# Altium project BMU_v50.PrjPcb (part 4 of 5)

## Sheet BMU_V50_MCUcomplex.SchDoc
size C
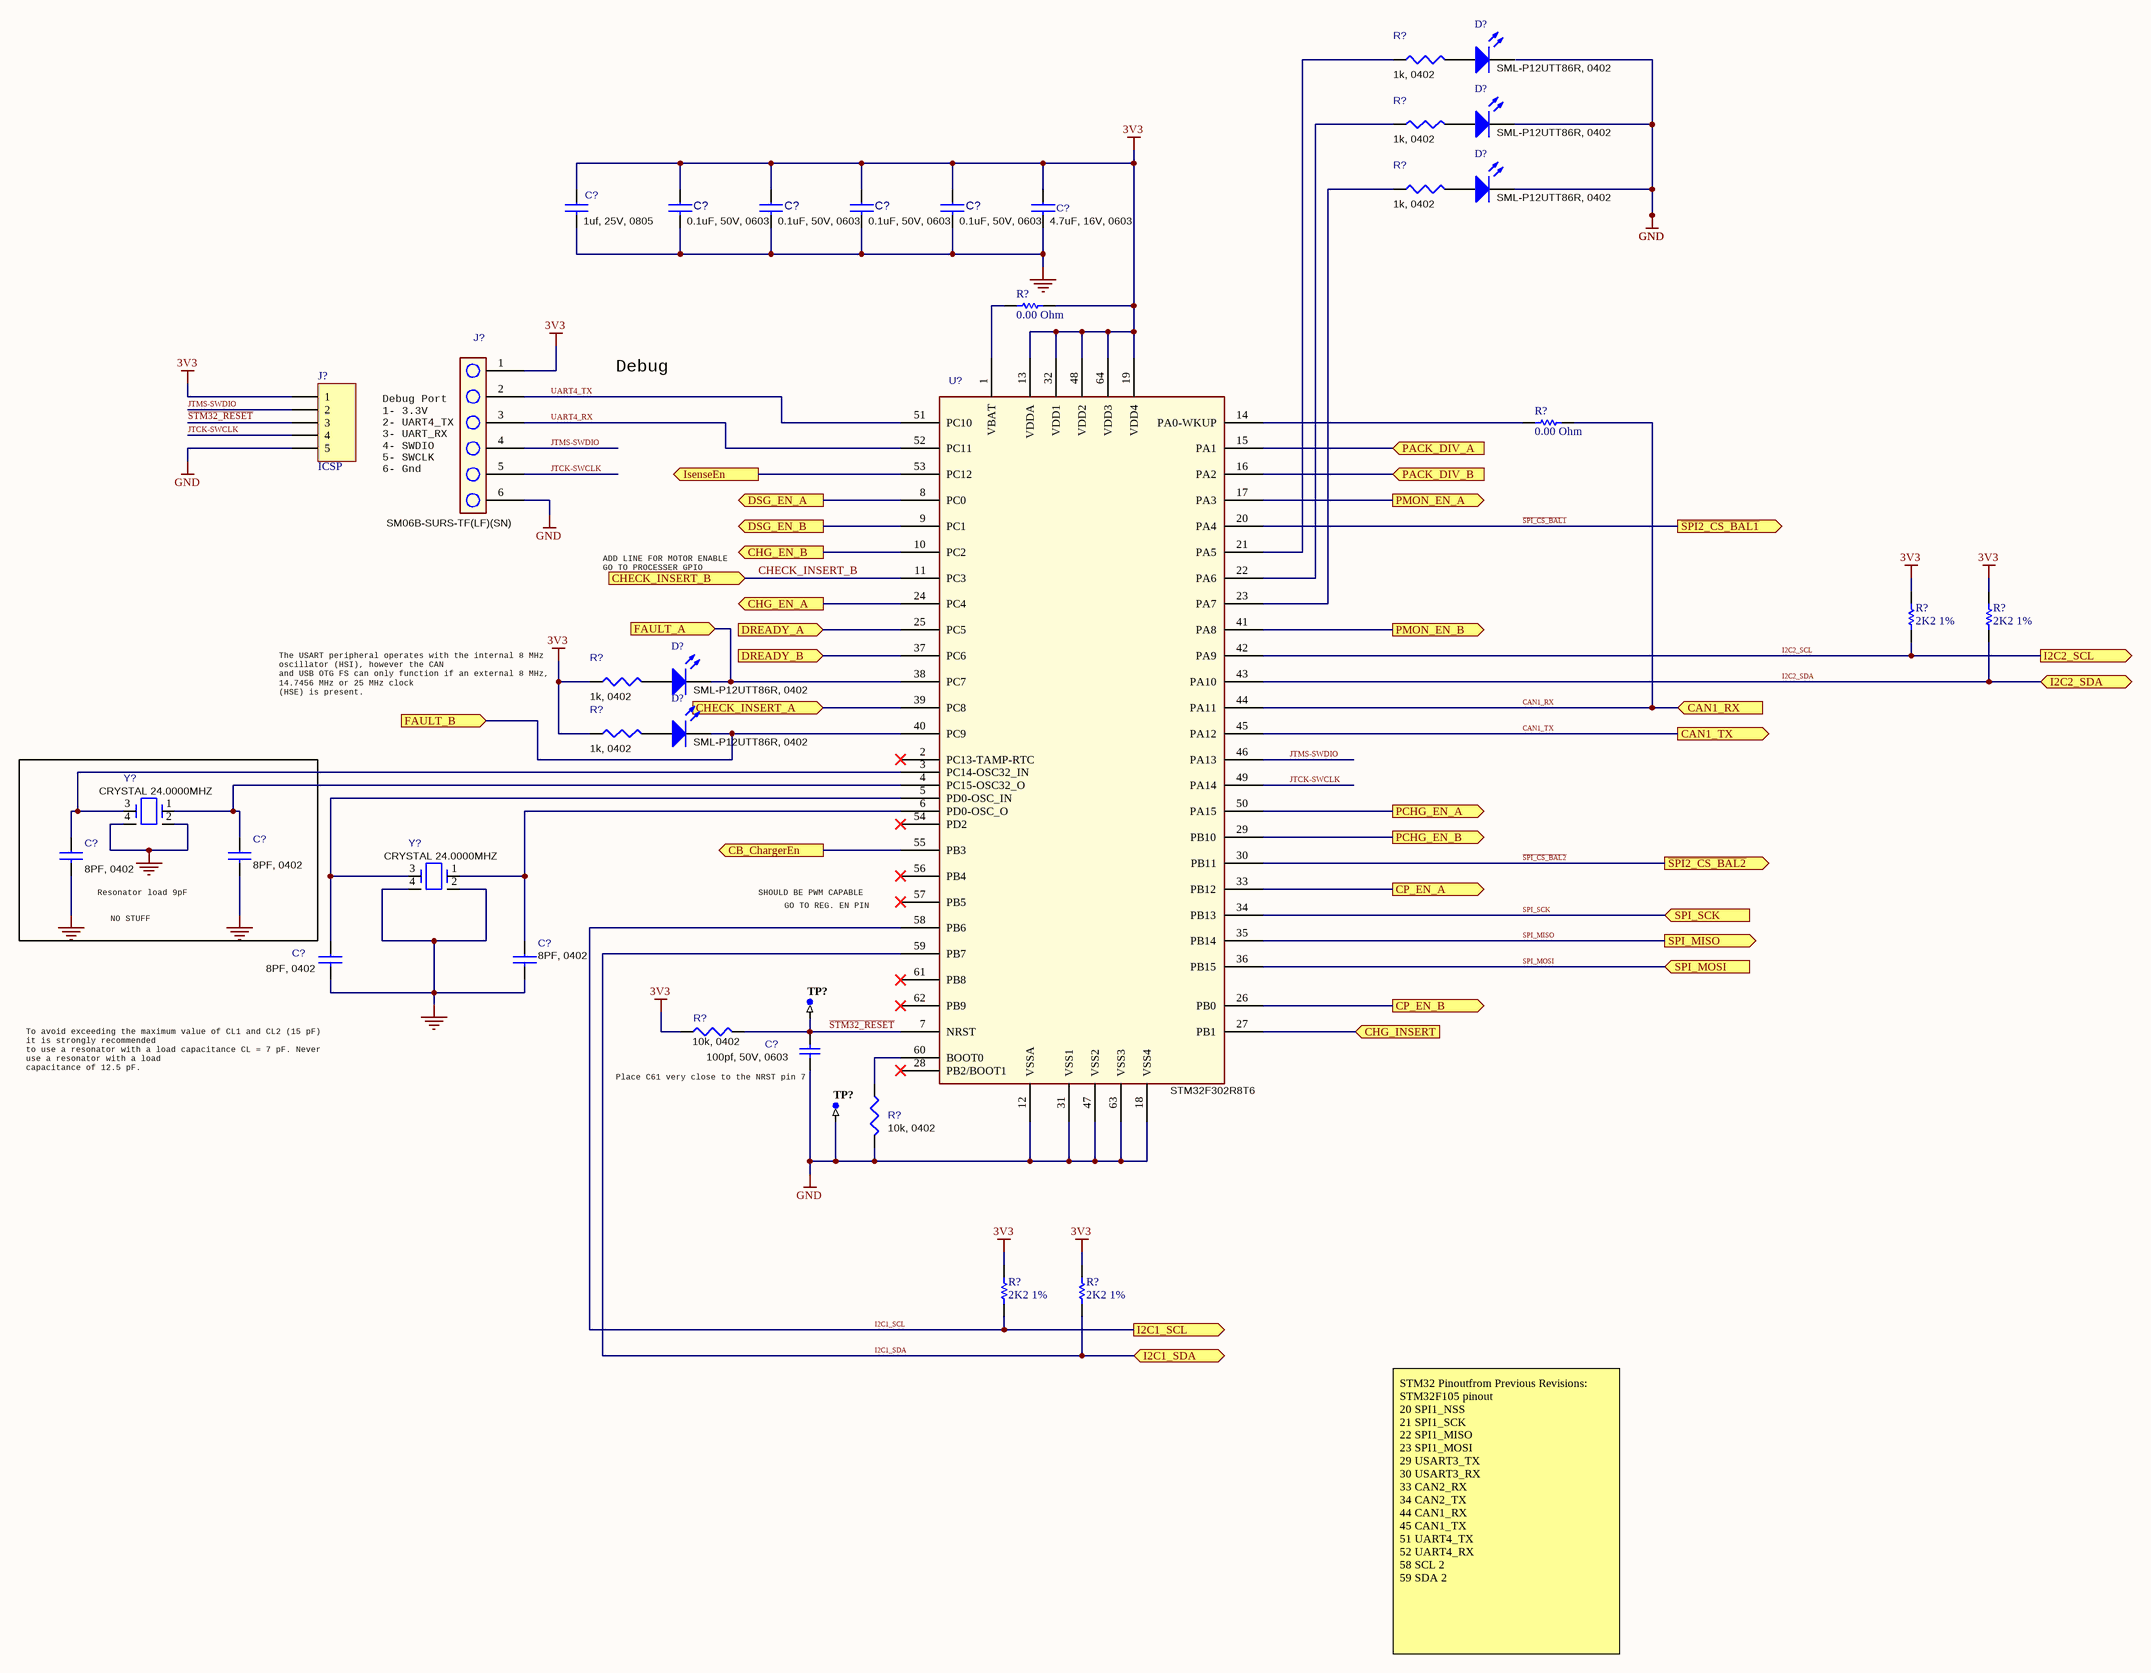
[diagram p9: BMU_V50_MCUcomplex.SchDoc]

### Parts
(Parts that share a designator on the sheet are numbered #1, #2 ... from top to bottom, then left to right.)
C?#1  1uf, 25V, 0805  [C0805]
C?#2  0.1uF, 50V, 0603  [C0603]
C?#3  0.1uF, 50V, 0603  [C0603]
C?#4  0.1uF, 50V, 0603  [C0603]
C?#5  0.1uF, 50V, 0603  [C0603]
C?#6  4.7uF, 16V, 0603  [C0805]
C?#7  8PF, 0402  [C0402]
C?#8  8PF, 0402  [C0402]
C?#9  8PF, 0402  [C0402]
C?#10  8PF, 0402  [C0402]
C?#11  100pf, 50V, 0603  [C0603]
D?#1  SML-P12UTT86R, 0402  [D0402_1]
D?#2  SML-P12UTT86R, 0402  [D0402_1]
D?#3  SML-P12UTT86R, 0402  [D0402_1]
D?#4  SML-P12UTT86R, 0402  [D0402_1]
D?#5  SML-P12UTT86R, 0402  [D0402_1]
J?#4  SM06B-SURS-TF(LF)(SN)  [0.8mm]
J?#5  ICSP  [TC2030-MCP-NL]  (no BOM)
R?#4  1k, 0402  [R0402]
R?#5  1k, 0402  [R0402]
R?#6  1k, 0402  [R0402]
R?#7  value 0.00 Ohm  [RESC0402(1005)_L]  (hidden comment: Jumper 0402(1005))
R?#8  value 0.00 Ohm  [RESC0402(1005)_L]  (hidden comment: Jumper 0402(1005))
R?#9  2K2 1%  [RESC0402(1005)_L]
R?#10  2K2 1%  [RESC0402(1005)_L]
R?#11  1k, 0402  [R0402]
R?#12  1k, 0402  [R0402]
R?#13  10k, 0402  [R0402]
R?#14  10k, 0402  [R0402]
R?#15  2K2 1%  [RESC0402(1005)_L]
R?#16  2K2 1%  [RESC0402(1005)_L]
TP?#1  TP-SM-C-100  [TP-SM-C-100]  (value not drawn)  (no BOM)
TP?#2  TP-SM-C-100  [TP-SM-C-100]  (value not drawn)  (no BOM)
U?#1  STM32F302R8T6  [64LQFP]
Y?#1  CRYSTAL 24.0000MHZ  [CRYSTAL_NX3225SA]
Y?#2  CRYSTAL 24.0000MHZ  [CRYSTAL_NX3225SA]

### Ports
CAN1_RX (in), CAN1_TX (out), CB_ChargerEn (out), CHECK_INSERT_A (in), CHECK_INSERT_B (in), CHG_EN_A (out), CHG_EN_B (out), CHG_INSERT (in), CP_EN_A (out), CP_EN_B (out), DREADY_A (in), DREADY_B (in), DSG_EN_A (out), DSG_EN_B (out), FAULT_A (in), FAULT_B (in), I2C1_SCL (out), I2C1_SDA (bidir), I2C2_SCL (out), I2C2_SDA (bidir), IsenseEn (out), PACK_DIV_A (in), PACK_DIV_B (in), PCHG_EN_A (out), PCHG_EN_B (out), PMON_EN_A (out), PMON_EN_B (out), SPI_MISO (out), SPI_MOSI (in), SPI_SCK (in), ~{SPI2_CS_BAL1} (out), ~{SPI2_CS_BAL2} (out)

### Nets
3V3: C?#1.1 C?#2.1 C?#3.1 C?#4.1 C?#5.1 C?#6.1 J?#4.1 J?#5.1 R?#7.1 R?#9.2 R?#10.2 R?#11.1 R?#12.1 R?#13.1 R?#15.2 R?#16.2 U?#1.13(VDDA) U?#1.19(VDD4) U?#1.32(VDD1) U?#1.48(VDD2) U?#1.64(VDD3)
GND: C?#1.2 C?#2.2 C?#3.2 C?#4.2 C?#5.2 C?#6.2 C?#7.2 C?#8.2 C?#9.2 C?#10.2 C?#11.1 D?#2.2(K) D?#3.2(K) J?#4.6 J?#5.5 R?#14.2 TP?#2.1 U?#1.12(VSSA) U?#1.18(VSS4) U?#1.31(VSS1) U?#1.47(VSS2) U?#1.63(VSS3) Y?#1.2 Y?#1.4 Y?#2.2 Y?#2.4
CAN1_RX: R?#8.1 U?#1.44(PA11) ; port CAN1_RX
CAN1_TX: U?#1.45(PA12) ; port CAN1_TX
CHECK_INSERT_B: U?#1.11(PC3) ; port CHECK_INSERT_B
I2C1_SCL: R?#15.1 U?#1.58(PB6) ; port I2C1_SCL
I2C1_SDA: R?#16.1 U?#1.59(PB7) ; port I2C1_SDA
I2C2_SCL: R?#9.1 U?#1.42(PA9) ; port I2C2_SCL
I2C2_SDA: R?#10.1 U?#1.43(PA10) ; port I2C2_SDA
JTCK-SWCLK: J?#4.5 J?#5.4 U?#1.49(PA14)
JTMS-SWDIO: J?#4.4 J?#5.2 U?#1.46(PA13)
~{SPI_CS_BAL1}: U?#1.20(PA4) ; port ~{SPI2_CS_BAL1}
~{SPI_CS_BAL2}: U?#1.30(PB11) ; port ~{SPI2_CS_BAL2}
~{STM32_RESET}: C?#11.2 J?#5.3 R?#13.2 TP?#1.1 U?#1.7(NRST)
SPI_MISO: U?#1.35(PB14) ; port SPI_MISO
SPI_MOSI: U?#1.36(PB15) ; port SPI_MOSI
SPI_SCK: U?#1.34(PB13) ; port SPI_SCK
UART4_RX: J?#4.3 U?#1.52(PC11)
UART4_TX: J?#4.2 U?#1.51(PC10)
NetC?#7_1: C?#7.1 U?#1.3(PC14-OSC32_IN) Y?#1.3
NetC?#8_1: C?#8.1 U?#1.4(PC15-OSC32_O) Y?#1.1
NetC?#9_1: C?#9.1 U?#1.5(PD0-OSC_IN) Y?#2.3
NetC?#10_1: C?#10.1 U?#1.6(PD0-OSC_O) Y?#2.1
NetD?#4_2: D?#4.2(K) U?#1.38(PC7) ; port FAULT_A
NetD?#5_2: D?#5.2(K) U?#1.40(PC9) ; port FAULT_B
NetJ?#3_4: U?#1.39(PC8) ; port CHECK_INSERT_A
NetR?#4_1: R?#4.1 U?#1.21(PA5)
NetR?#5_1: R?#5.1 U?#1.22(PA6)
NetR?#6_1: R?#6.1 U?#1.23(PA7)
NetR?#7_2: R?#7.2 U?#1.1(VBAT)
NetR?#8_2: R?#8.2 U?#1.14(PA0-WKUP)
NetR?#14_1: R?#14.1 U?#1.60(BOOT0)
NetR?_StringA_U_BMU_V50_StringPWRControl#12_1: U?#1.15(PA1) ; port PACK_DIV_A
NetR?_StringB_U_BMU_V50_StringPWRControl#12_1: U?#1.16(PA2) ; port PACK_DIV_B
NetU?#1_8: U?#1.8(PC0) ; port DSG_EN_A
NetU?#1_9: U?#1.9(PC1) ; port DSG_EN_B
NetU?#1_10: U?#1.10(PC2) ; port CHG_EN_B
NetU?#1_17: U?#1.17(PA3) ; port PMON_EN_A
NetU?#1_24: U?#1.24(PC4) ; port CHG_EN_A
NetU?#1_25: U?#1.25(PC5) ; port DREADY_A
NetU?#1_26: U?#1.26(PB0) ; port CP_EN_B
NetU?#1_27: U?#1.27(PB1) ; port CHG_INSERT
NetU?#1_29: U?#1.29(PB10) ; port PCHG_EN_B
NetU?#1_33: U?#1.33(PB12) ; port CP_EN_A
NetU?#1_37: U?#1.37(PC6) ; port DREADY_B
NetU?#1_41: U?#1.41(PA8) ; port PMON_EN_B
NetU?#1_50: U?#1.50(PA15) ; port PCHG_EN_A
NetU?#1_53: U?#1.53(PC12) ; port IsenseEn
NetU?#1_55: U?#1.55(PB3) ; port CB_ChargerEn

Not connected (* = marked no-connect by the designer): D?#1 1(A) 2(K); D?#2 1(A); D?#3 1(A); D?#4 1(A); D?#5 1(A); R?#4 2; R?#5 2; R?#6 2; R?#11 2; R?#12 2; U?#1 2(PC13-TAMP-RTC)* 28(PB2/BOOT1)* 54(PD2)* 56(PB4)* 57(PB5)* 61(PB8)* 62(PB9)*

### Notes on the sheet
- Debug
- (near J?#4) Debug Port
  1- 3.3V
  2- UART4_TX
  3- UART_RX
  4- SWDIO
  5- SWCLK
  6- Gnd
- ADD LINE FOR MOTOR ENABLE
  GO TO PROCESSER GPIO
- (near R?#11) The USART peripheral operates with the internal 8 MHz
  oscillator (HSI), however the CAN
  and USB OTG FS can only function if an external 8 MHz,
  14.7456 MHz or 25 MHz clock
  (HSE) is present.
- (near C?#7) Resonator load 9pF
- NO STUFF
- SHOULD BE PWM CAPABLE
- GO TO REG. EN PIN
- To avoid exceeding the maximum value of CL1 and CL2 (15 pF)
  it is strongly recommended
  to use a resonator with a load capacitance CL = 7 pF. Never
  use a resonator with a load
  capacitance of 12.5 pF.
- (near C?#11) Place C61 very close to the NRST pin 7
- STM32 Pinoutfrom Previous Revisions:
  STM32F105 pinout
  20 SPI1_NSS
  21 SPI1_SCK
  22 SPI1_MISO
  23 SPI1_MOSI
  29 USART3_TX
  30 USART3_RX
  33 CAN2_RX
  34 CAN2_TX
  44 CAN1_RX
  45 CAN1_TX
  51 UART4_TX
  52 UART4_RX
  58 SCL 2
  59 SDA 2
- Title
- MATTERNET
- PROPRIETRY & CONFIDENTIAL
  THE INFORMATION CONTAINS IN THIS DRAWING
  IS THE SOLE PROPERTY OF  MATTERNET Inc.
  ANY REPRODUCTION IN PART OR AS WHOLE
  WITHOUT A WRITTEN PERMISSION OF
  MATTERNET Inc. IS PROHIBITED
- Size:
- Date:
- File:
- C
- Number:
- Time:
- Revision:
- Sheet
- of
- 161 E. Evelyn Ave.
- Mountain View,
- CA 94041 USA

### Library data of the parts
C?#1 = CAP-Generic-0402: CAP CER 1UF 25V X7R 0805; Manufacturer: Murata; Manufacturer Part Number: GCJ21BR71E105KA12L; Tolerance: 10%; Supplier 1: Digi-Key; Supplier Part Number 1: 490-5802-1-ND; Stock 1: 116649; Pricing 1: 1=0.48, 10=0.333, 100=0.1997, 500=0.14974, 1000=0.12645 (USD); Mount: Surface Mount; Case/Package: 0805; Case Code (Imperial): 0805; Case Code (Metric): 2012; Min Operating Temperature: -55°C; Max Operating Temperature: 125°C; Capacitance: 1uF; Voltage Rating: 25V; Voltage Rating (DC): 25V; Packaging: Tape and Reel; Package Quantity: 3000; Dielectric: X7R; Termination: SMD/SMT; Features: Soft Termination; Length: 2mm; Width: 1.25mm; Thickness: 0.057inch; Depth: 1.25mm; Ratings: AEC-Q200; Lead Free: Lead Free
C?#2-C?#5 = CAP-Generic-0603: CAP CER 0.1UF 50V 10% X7R 0603; Manufacturer: Murata; Manufacturer Part Number: GCJ188R71E104KA12D; Supplier 1: Digi-Key; Supplier Part Number 1: 490-16477-1-ND; Stock 1: 2560; Pricing 1: 1=0.22, 10=0.152, 100=0.077, 500=0.0527, 1000=0.04662 (USD); Case/Package: 0603; Supplier 2: Mouser; Supplier Part Number 2: 81-GCJ188R71E104KA2D; Stock 2: 47905; Pricing 2: 1=0.21, 10=0.139, 50=0.139, 100=0.071, 1000=0.043, 10000=0.035 (USD)
C?#6 = CAP-Generic-0603: CAP CER 4.7UF 16V 10% X7R 0805; Manufacturer: TDK; Manufacturer Part Number: CGA4J3X7R1C475K125AE; Supplier 1: Digi-Key; Supplier Part Number 1: 445-8788-1-ND; Stock 1: 255080; Pricing 1: 1=0.7, 10=0.498, 100=0.3279, 500=0.24288, 1000=0.20645 (USD); Mount: Surface Mount; Case/Package: 0805; Weight: 0.000194oz; Case Code (Imperial): 0805; Case Code (Metric): 2012; Min Operating Temperature: -55°C; Max Operating Temperature: 125°C; Capacitance: 4.7uF; Tolerance: 10%; Packaging: Tape and Reel; Voltage Rating: 16V; Termination: SMD/SMT; Voltage Rating (DC): 16V; Package Quantity: 1; Dielectric: X7R; Features: Soft Termination; Length: 2mm; Height: 1.25mm; Width: 1.2mm; Thickness: 0.057inch; Depth: 1.25mm; Ratings: AEC-Q200; REACH SVHC: No SVHC; ComponentLink1URL: http://www.mouser.com/ds/2/400/lcc_commercial_soft_en-775842.pdf?src-supplier=Mouser; ComponentLink1Description: http://www.mouser.com/ds/2/400/lcc_commercial_soft_en-775842.pdf?src-supplier=Mouser; ComponentLink2URL: http://www.farnell.com/datasheets/1863333.pdf?src-supplier=Element14; ComponentLink2Description: http://www.farnell.com/datasheets/1863333.pdf?src-supplier=Element14; Supplier 2: Mouser; Supplier Part Number 2: 810-CGA4J3X7R1C475KS; Stock 2: 3160; Pricing 2: 1=0.7, 10=0.498, 50=0.498, 100=0.328, 1000=0.207, 10000=0.176 (USD)
C?#7-C?#10 = CAP-Generic-0402: CAP CER 8PF 50V C0G 0402; Manufacturer: TDK; Manufacturer Part Number: CGA2B2C0G1H080D050BA; ComponentLink1URL: http://www.mouser.com/ds/2/400/lcc_commercial_general_en-837201.pdf; ComponentLink1Description: http://www.mouser.com/ds/2/400/lcc_commercial_general_en-837201.pdf; ComponentLink2URL: https://product.tdk.com/info/en/documents/chara_sheet/C1005C0G1H080C050BA.pdf; ComponentLink2Description: https://product.tdk.com/info/en/documents/chara_sheet/C1005C0G1H080C050BA.pdf; Supplier 1: Digi-Key; Supplier Part Number 1: 445-5582-1-ND; Stock 1: 4049; Pricing 1: 1=0.1, 10=0.076, 100=0.0338, 500=0.02416, 1000=0.01898, 2500=0.01725, 5000=0.01587 (USD); Mount: Surface Mount; Case/Package: 0402; Weight: 2.3E-05oz; Case Code (Imperial): 0402; Case Code (Metric): 1005; Min Operating Temperature: -55°C; Max Operating Temperature: 125°C; Capacitance: 8pF; Voltage Rating: 50V; Voltage Rating (DC): 50V; Packaging: Tape and Reel; Dielectric: C0G; Termination: SMD/SMT; Package Quantity: 10000; Composition: Ceramic; Length: 1mm; Height: 0.5mm; Width: 0.5mm; Thickness: 0.022inch; Depth: 0.5mm; Ratings: AEC-Q200; REACH SVHC: No SVHC; ComponentLink3URL: http://www.mouser.com/ds/2/400/lcc_automotive_general_en-843974.pdf; ComponentLink3Description: http://www.mouser.com/ds/2/400/lcc_automotive_general_en-843974.pdf; ComponentLink4URL: http://www.farnell.com/datasheets/1807242.pdf; ComponentLink4Description: http://www.farnell.com/datasheets/1807242.pdf
C?#11 = Cap: CAP CER 100PF 50V NP0 0603; Manufacturer: TDK; Manufacturer Part Number: CGA3E2C0G1H101J080AE; Tolerance: 5%; Supplier 1: Digi-Key; Supplier Part Number 1: 445-173653-1-ND; Stock 1: 2011; Pricing 1: 1=0.27, 10=0.186, 100=0.0944, 500=0.06458, 1000=0.05713 (USD); Mount: Surface Mount; Case/Package: 0603; Case Code (Metric): 1608; Case Code (Imperial): 0603; Min Operating Temperature: -55°C; Max Operating Temperature: 125°C; Packaging: Tape and Reel; Capacitance: 100pF; Voltage Rating: 50V; Features: Soft Termination; Length: 0.063inch; Width: 0.031inch; Thickness: 0.037inch; Ratings: AEC-Q200; Supplier 2: Mouser; Supplier Part Number 2: 810-CGA3E2C0G1H101JA; Stock 2: 41170; Pricing 2: 1=0.27, 10=0.186, 50=0.186, 100=0.095, 1000=0.058, 10000=0.044 (USD)
D?#1-D?#5 = LED0: LED Uni-Color Red Chip LED 2-Pin 0402 T/R; Manufacturer: Rohm; Manufacturer Part Number: SML-P12U2TT86R; Lens Color: Colorless; Lens Transparency: Clear; Luminous Intensity: 70mcd; Test Current: 20mA; Dominant Wavelength: 615nm; Forward Voltage: 2V; Supplier 1: Digi-Key; Supplier Part Number 1: 846-1192-1-ND; Stock 1: 9518; Pricing 1: 1=0.45, 10=0.327, 25=0.2504, 100=0.1634, 250=0.1198, 500=0.10164, 1000=0.08349, 2500=0.0726 (USD); Mount: Surface Mount; Case/Package: 0402; Color: Red; Case Code (Metric): 1006; Case Code (Imperial): 0402; Packaging: Cut Tape; Length: 1mm; Height: 0.25mm; Width: 0.6mm; Lead Free: Lead Free; Supplier 2: Mouser; Supplier Part Number 2: 755-SML-P12U2TT86R; Stock 2: 13361; Pricing 2: 1=0.37, 10=0.238, 50=0.238, 100=0.102, 1000=0.079, 10000=0.06 (USD)
J?#4 = CONN-GENERIC-1X6: Headers & Wire Housings 6P SR UNSHRD HRD TIN OVER NI; Manufacturer: JST; custprt: 100-0410-000212; custinv: Ansync; Option: A; Number of Positions: 6; Connector Type: Outer Shroud Contact; Pitch: 0.031inch; Supplier 1: Digi-Key; Supplier Part Number 1: SM06B-SURS-TF(LF)(SN)-ND; Manufacturer Part Number: SM06B-SURS-TF(LF)(SN); Stock 1: 0; Pricing 1: 3500=0.43193 (USD); Mount: Surface Mount; Colour: Natural; Contact Plating: Tin; Number of Rows: 1; Packaging: Tape and Reel; Termination: Solder; ComponentLink1URL: http://www.jst-mfg.com/product/pdf/eng/eSUR.pdf; ComponentLink1Description: http://www.jst-mfg.com/product/pdf/eng/eSUR.pdf
R?#4-R?#6 R?#11 R?#12 = R-Generic-0402: RES SMD 1K OHM 5% 1/16W 0402; Manufacturer: Yageo; Manufacturer Part Number: RC0402JR-071KL; custinv: Ansync; custprt: 100-0120-000074; Option: AB; Resistance: 1kR; Power Rating: 62.5mW; Voltage Rating: 50V; Temperature Coefficient: 100ppm/°C; Max Power Dissipation: 63mW; Supplier 1: Digi-Key; Supplier Part Number 1: 311-1.0KJRCT-ND; Stock 1: 18546768; Pricing 1: 1=0.1, 10=0.015, 100=0.006, 1000=0.00268, 2500=0.00233, 5000=0.00192 (USD); Case/Package: 0402; Case Code (Imperial): 0402; Case Code (Metric): 1005; Min Operating Temperature: -55°C; Max Operating Temperature: 155°C; Tolerance: 5%; Packaging: Tape and Reel; Package Quantity: 1; Termination: SMD/SMT; Composition: Thick Film; Number of Terminations: 2; Military Standard: Not; Features: Moisture Resistant; Length: 0.039inch; Height: 0.016inch; Width: 0.02inch; Depth: 0.5mm; REACH SVHC: No SVHC; Lead Free: Lead Free; ComponentLink1URL: http://www.yageo.com/documents/recent/PYu-RC_Group_51_RoHS_L_9.pdf; ComponentLink1Description: http://www.yageo.com/documents/recent/PYu-RC_Group_51_RoHS_L_9.pdf; ComponentLink2URL: http://www.farnell.com/datasheets/1018594.pdf; ComponentLink2Description: http://www.farnell.com/datasheets/1018594.pdf; ComponentLink3URL: http://www.yageo.com/documents/recent/PYu-RC0402_51_RoHS_L_6_r.pdf; ComponentLink3Description: http://www.yageo.com/documents/recent/PYu-RC0402_51_RoHS_L_6_r.pdf
R?#7 R?#8 = CMP-1011-00001-1: Jumper 0402 (1005 Metric); Tolerance: None; Case-Metric: 1005; Case-EIA: 0402; Power: None; Technology: SMT
R?#9 R?#10 R?#15 R?#16 = CMP-1011-00546-1: 2K2 0.063W 1% 0402 (1005 Metric)  SMD; Case-Metric: 1005; Case-EIA: 0402; Value: 2200.00 Ohm; Power: 0.063 W; Tolerance: 1 %; Technology: SMT
R?#13 R?#14 = R-Generic-0402: RES SMD 10K OHM 1% 1/16W 0402; Manufacturer: Vishay Dale; Manufacturer Part Number: CRCW040210K0FKTD; Resistance: 10kR; Power Rating: 63mW; Voltage Rating: 50V; Temperature Coefficient: 100ppm/°C; ComponentLink1URL: http://www.yageo.com/documents/recent/PYu-RC_Group_51_RoHS_L_9.pdf; ComponentLink1Description: http://www.yageo.com/documents/recent/PYu-RC_Group_51_RoHS_L_9.pdf; ComponentLink2URL: http://www.mouser.com/ds/2/447/PYu-RC0402_51_RoHS_L_6_r-8721.pdf; ComponentLink2Description: http://www.mouser.com/ds/2/447/PYu-RC0402_51_RoHS_L_6_r-8721.pdf; ComponentLink3URL: http://www.farnell.com/datasheets/1018594.pdf; ComponentLink3Description: http://www.farnell.com/datasheets/1018594.pdf; Supplier 1: Digi-Key; Supplier Part Number 1: 541-2955-1-ND; Stock 1: 17223; Pricing 1: 1=0.15, 10=0.132, 100=0.0508, 1000=0.02236, 2500=0.01931, 5000=0.01728 (USD); Mount: Surface Mount; Case/Package: 0402; Number of Pins: 2; Weight: 2.3E-05oz; Case Code (Metric): 1005; Case Code (Imperial): 0402; Contact Plating: Lead,Tin; Min Operating Temperature: -55°C; Max Operating Temperature: 155°C; Tolerance: 1%; Packaging: Tape and Reel; Package Quantity: 10000; Composition: Thick Film; Number of Terminations: 2; Military Standard: Not; Max Power Dissipation: 63mW; Voltage Rating (DC): 50V; Features: Automotive AEC-Q200; Length: 1mm; Height: 0.016inch; Width: 0.02inch; Depth: 0.5mm; Radiation Hardening: No; Lead Free: Contains Lead; REACH SVHC: Unknown; ComponentLink4URL: http://www.vishay.com/docs/20008/dcrcw.pdf?src-supplier=Digi-Key; ComponentLink4Description: http://www.vishay.com/docs/20008/dcrcw.pdf?src-supplier=Digi-Key; ComponentLink5URL: https://www.verical.com/server-webapp/html/getDatasheet?partID=104182&src-supplier=Verical; ComponentLink5Description: https://www.verical.com/server-webapp/html/getDatasheet?partID=104182&src-supplier=Verical; ComponentLink6URL: http://www.vishay.com/docs/20008/dcrcw.pdf?src-supplier=Avnet; ComponentLink6Description: http://www.vishay.com/docs/20008/dcrcw.pdf?src-supplier=Avnet
TP?#1 TP?#2 = CMP-0484-00002-2: Test Point, Surface Mount, Circular, Pad Diameter 1 mm; Manufacturer: No Vendor; PartNumber: TP-SM-C-100
U?#1 = MCU-STM32F105RBT6-700-443: MCU 32-bit STM32 ARM Cortex M4 RISC 128KB Flash 2.5V/3.3V 64-Pin LQFP Tray; Manufacturer 1: STMicroelectronics; Manufacturer Part Number 1: STM32F302RBT6; Peripherals: POR,PWM,WDT,DMA; Interface: I2C,SPI,USB,CAN,I2S,UART,USART,IrDA,LIN; Number of I/Os: 27; Frequency: 72MHz; Oscillator Type: Internal; Number of USB Channels: 1; Number of SPI Channels: 3; Number of I2C Channels: 2; Number of PWM Channels: 6; Number of Programmable I/O: 52; Min Supply Voltage: 2V; Watchdog Timer: Yes; RAM Size: 32KB; Number of Timers/Counters: 8; Max Supply Voltage: 3.6V; Data Bus Width: 32b; ComponentLink1URL: http://www.st.com/web/en/resource/technical/document/datasheet/DM00094064.pdf; ComponentLink1Description: http://www.st.com/web/en/resource/technical/document/datasheet/DM00094064.pdf; ComponentLink2URL: http://www.farnell.com/datasheets/1824148.pdf; ComponentLink2Description: http://www.farnell.com/datasheets/1824148.pdf; ComponentLink3URL: https://datasheet.ciiva.com/12270/dm00058181-101707-12270628.pdf?src-supplier=Mouser; ComponentLink3Description: https://datasheet.ciiva.com/12270/dm00058181-101707-12270628.pdf?src-supplier=Mouser; ComponentLink4URL: https://datasheet.ciiva.com/22691/1880973-22691996.pdf?src-supplier=Element14; ComponentLink4Description: https://datasheet.ciiva.com/22691/1880973-22691996.pdf?src-supplier=Element14; ComponentLink5URL: https://datasheet.ciiva.com/29719/dm00094064-29719691.pdf?src-supplier=Digi-Key; ComponentLink5Description: https://datasheet.ciiva.com/29719/dm00094064-29719691.pdf?src-supplier=Digi-Key; Supplier 1: Digi-Key; Supplier Part Number 1: 497-17416-ND; RoHS: Yes; Category: Microcontrollers; Stock 1: 1015; Pricing 1: 1=4.79000, 10=4.30300, 25=4.06760, 100=3.52540, 250=3.34460, 500=3.00112, 1000=2.53106, 2500=2.40451, 5000=2.31411 (USD); Case/Package: LQFP; Number of Pins: 64; Contact Plating: Gold; Min Operating Temperature: -40°C; Max Operating Temperature: 85°C; Memory Type: FLASH; Memory Size: 128KB; Core Architecture: ARM; Packaging: Tray; Max Frequency: 72MHz; Number of UART Channels: 2; Number of ADC Channels: 1; Package Quantity: 960; Length: 10.2mm; Height: 1.45mm; Width: 10.2mm; Radiation Hardening: No; REACH SVHC: No SVHC; Lead Free: Lead Free
Y?#1 Y?#2 = CRY-Generic: CRYSTAL 24.0000MHZ 8PF SMD; Manufacturer: NDK; Manufacturer Part Number: NX3225SA-24.000MHZ-STD-CSR-1; custinv: Ansync; custprt: 100-0830-000044; Option: AB; Frequency: 24MHz; Frequency Tolerance: 15ppm; ESR (Equivalent Series Resistance): 50R; Supplier 1: Digi-Key; Supplier Part Number 1: 644-1052-1-ND; Stock 1: 48121; Pricing 1: 1=0.75, 10=0.663, 50=0.6196, 100=0.5476, 500=0.51876, 1000=0.4323 (USD); Mount: Surface Mount; Case/Package: SMD/SMT; Min Operating Temperature: -10°C; Max Operating Temperature: 75°C; Packaging: Tape and Reel; Load Capacitance: 8pF; Frequency Stability: 15ppm; Length: 0.126inch; Height: 0.028inch; Width: 0.098inch; Supplier 2: Mouser; Supplier Part Number 2: 344-NX3225SA24MCSR1; Stock 2: 5833; Pricing 2: 1=0.71, 10=0.587, 50=0.587, 100=0.519, 1000=0.41, 10000=0.335 (USD)

## Sheet BMU_V50_MCUpower.SchDoc
size C
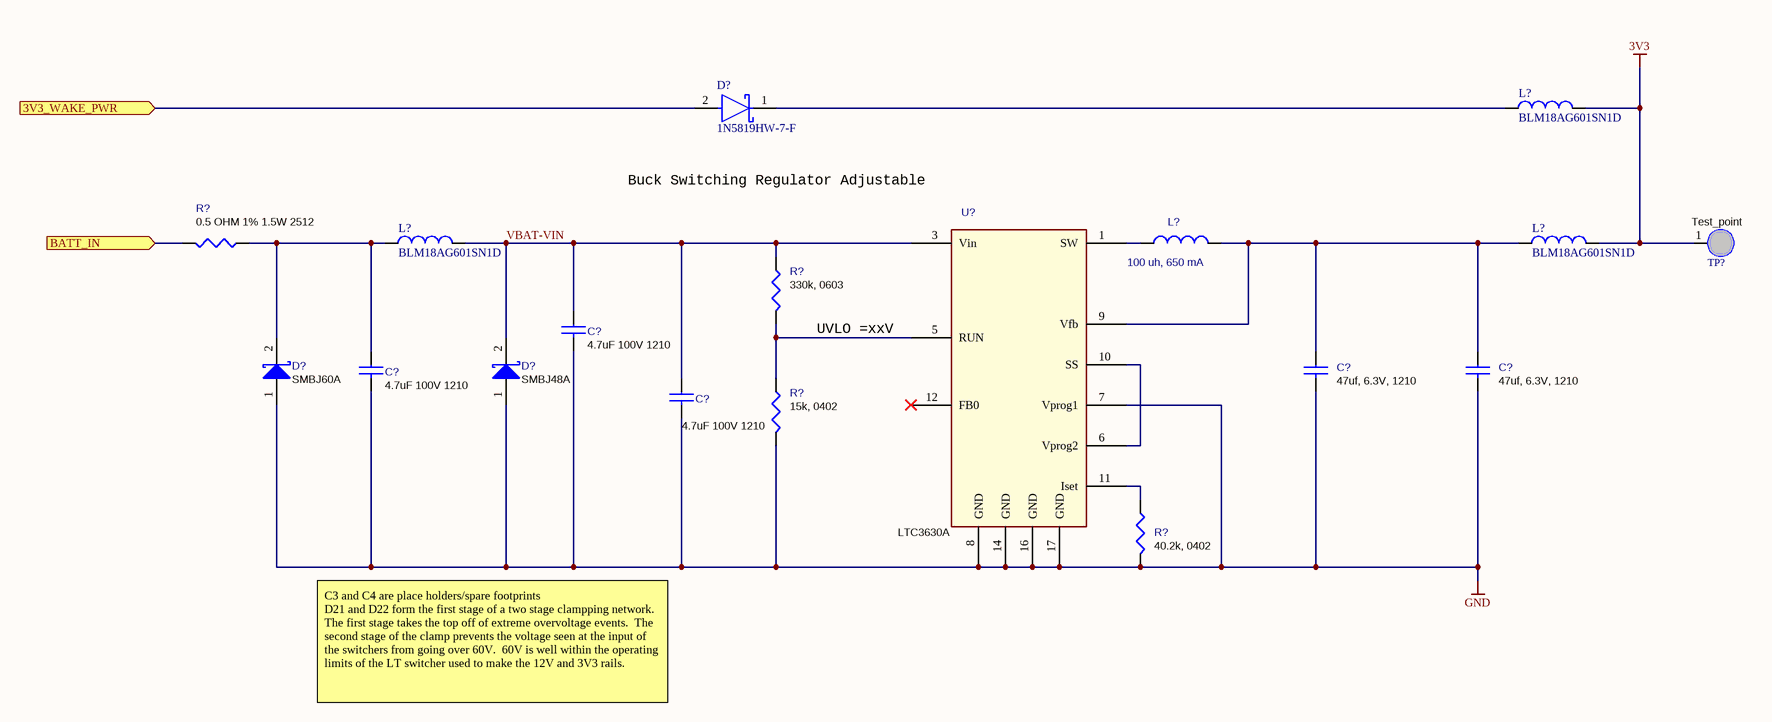
[diagram p10: BMU_V50_MCUpower.SchDoc]

### Parts
(Parts that share a designator on the sheet are numbered #1, #2 ... from top to bottom, then left to right.)
C?#12  4.7uF 100V 1210  [C1210]
C?#13  4.7uF 100V 1210  [C1210]
C?#14  47uf, 6.3V, 1210  [C1210_N]
C?#15  47uf, 6.3V, 1210  [C1210_N]
C?#16  4.7uF 100V 1210  [C1210]
D?#6  1N5819HW-7-F  [FP-SOD123-MFG]
D?#7  SMBJ60A  [DO-214AA]
D?#8  SMBJ48A  [DO-214AA]
L?#1  BLM18AG601SN1D  [INDC1608X10N]
L?#2  BLM18AG601SN1D  [INDC1608X10N]
L?#3  100 uh, 650 mA  [IND_SRR7045]
L?#4  BLM18AG601SN1D  [INDC1608X10N]
R?#17  0.5 OHM 1% 1.5W 2512  [2512]
R?#18  330k, 0603  [R0603]
R?#19  15k, 0402  [R0402]
R?#20  40.2k, 0402  [R0402]
TP?#3  Test_point  [TP]  (no BOM)
U?#2  LTC3630A  [LTC3630A]

### Ports
3V3_WAKE_PWR (in), BATT_IN (in)

### Nets
3V3: L?#1.2 L?#4.2 TP?#3.1
GND: C?#12.2 C?#13.2 C?#14.2 C?#15.2 C?#16.2 D?#7.1(A) D?#8.1(A) R?#19.2 R?#20.2 U?#2.7(Vprog1) U?#2.8(GND) U?#2.14(GND) U?#2.16(GND) U?#2.17(GND)
VBAT-VIN: C?#12.1 C?#16.1 D?#8.2(K) L?#2.2 R?#18.1 U?#2.3(Vin)
NetC?#13_1: C?#13.1 D?#7.2(K) L?#2.1 R?#17.1
NetC?#14_1: C?#14.1 C?#15.1 L?#3.2 L?#4.1 U?#2.9(Vfb)
NetC?_StringA_U_BMU_V50_StringPWRControl#2_2: R?#17.2 ; port BATT_IN
NetD?#6_1: D?#6.1(C) L?#1.1
NetD?#6_2: D?#6.2(A) ; port 3V3_WAKE_PWR
NetL?#3_1: L?#3.1 U?#2.1(SW)
NetR?#18_2: R?#18.2 R?#19.1 U?#2.5(RUN)
NetR?#20_1: R?#20.1 U?#2.11(Iset)
NetU?#2_6: U?#2.6(Vprog2) U?#2.10(SS)

Not connected (* = marked no-connect by the designer): U?#2 12(FB0)*

### Notes on the sheet
- Buck Switching Regulator Adjustable
- (near R?#18) UVLO =xxV
- C3 and C4 are place holders/spare footprints
  D21 and D22 form the first stage of a two stage clampping network. The first stage takes the top off of extreme overvoltage events.  The second stage of the clamp prevents the voltage seen at the input of the switchers from going over 60V.  60V is well within the operating limits of the LT switcher used to make the 12V and 3V3 rails.
- Title
- MATTERNET
- PROPRIETRY & CONFIDENTIAL
  THE INFORMATION CONTAINS IN THIS DRAWING
  IS THE SOLE PROPERTY OF  MATTERNET Inc.
  ANY REPRODUCTION IN PART OR AS WHOLE
  WITHOUT A WRITTEN PERMISSION OF
  MATTERNET Inc. IS PROHIBITED
- Size:
- Date:
- File:
- C
- Number:
- Time:
- Revision:
- Sheet
- of
- 161 E. Evelyn Ave.
- Mountain View,
- CA 94041 USA

### Library data of the parts
C?#12 C?#13 C?#16 = CAP-GENERIC: CAP CER 4.7UF 100V 10% X7S 1210; Manufacturer: TDK; Manufacturer Part Number: CGA6M3X7S2A475K200AE; ComponentLink1URL: http://www.mouser.com/ds/2/400/lcc_automotive_midvoltage_en-355485.pdf; ComponentLink1Description: http://www.mouser.com/ds/2/400/lcc_automotive_midvoltage_en-355485.pdf; ComponentLink2URL: http://www.farnell.com/datasheets/1839935.pdf; ComponentLink2Description: http://www.farnell.com/datasheets/1839935.pdf; Supplier 1: Digi-Key; Supplier Part Number 1: 445-8790-1-ND; Stock 1: 0; Pricing 1: 1=2.3, 10=1.86, 100=1.42, 500=1.08192 (USD); Mount: Surface Mount; Case/Package: 1210; Weight: 0.000564oz; Case Code (Metric): 3225; Case Code (Imperial): 1210; Min Operating Temperature: -55°C; Max Operating Temperature: 125°C; Tolerance: 10%; Packaging: Tape and Reel; Capacitance: 4.7uF; Voltage Rating: 100V; Termination: SMD/SMT; Package Quantity: 1; Voltage Rating (DC): 100V; Dielectric: X7S; Features: Soft Termination; Length: 3.2mm; Height: 2mm; Width: 0.098inch; Thickness: 0.087inch; Depth: 2.5mm; Ratings: AEC-Q200; REACH SVHC: No SVHC; Lead Free: Lead Free; ComponentLink3URL: http://www.mouser.com/ds/2/400/lcc_commercial_soft_en-775842.pdf; ComponentLink3Description: http://www.mouser.com/ds/2/400/lcc_commercial_soft_en-775842.pdf; Supplier 2: Mouser; Supplier Part Number 2: 810-CGA6M3X7S2A475KS; Stock 2: 205; Pricing 2: 1=2.3, 10=1.86, 50=1.86, 100=1.42, 1000=0.98, 10000=0.98 (USD)
C?#14 C?#15 = CAP-Generic-1206: CAP CER 47UF 6.3V X7R 1210; Manufacturer: Murata; Manufacturer Part Number: GCJ32ER70J476KE01L; Tolerance: 10%; Supplier 1: Digi-Key; Supplier Part Number 1: 490-10559-1-ND; Stock 1: 4874; Pricing 1: 1=1.53, 10=1.212, 100=0.9089, 500=0.6867 (USD); Mount: Surface Mount; Case/Package: 1210; Weight: 0.00388oz; Case Code (Metric): 3225; Case Code (Imperial): 1210; Min Operating Temperature: -55°C; Max Operating Temperature: 125°C; Capacitance: 47uF; Packaging: Tape and Reel; Voltage Rating: 6.3V; Dielectric: X7R; Termination: SMD/SMT; Voltage Rating (DC): 6.3V; Package Quantity: 1000; Features: Soft Termination; Length: 0.126inch; Height: 2.5mm; Width: 0.098inch; Thickness: 0.11inch; Ratings: AEC-Q200; Lead Free: Lead Free
D?#6 = CMP-12790-000018-1: DIODE SCHOTTKY 40V 1A SOD123; Manufacturer: Diodes Inc; Max Surge Forward Current: 25A; Peak Reverse Current: 1mA; Max Junction Temp: +125°C; Import Ts: 1521843113; Vr V: 40; Standoff Height: 0mm; Capacitance: 50pF; Value: 50pF; Ciiva Ids: 815630; If A: 1; Automotive: No; Device Class L1: Discrete Semiconductors; Octopart: https://octopart.com/1n5819hw-7-f-diodes+inc.-323197; Terminal Temperature Tt Degc: 90; ComponentLink2Description: Datasheet; Temperature Range High: +125°C; Package: SOD123; Reverse Voltage: 40V; Temperature Range Low: -65°C; Mouser Description: 1N5819HW Series 40 V 1 A Surface Mount Schottky Barrier Rectifier - SOD-123; Device Class L2: Diodes; Lead Free: Yes; Max Repetitive Reverse Voltage: 40V; Ipc Land Pattern Name: SOD365155X123-2; Forward Current: 1A; Device Class L3: Schottky Diodes; Digikey Description: DIODE SCHOTTKY 40V 1A SOD123; ComponentLink2URL: https://www.diodes.com/assets/Datasheets/ds30217.pdf; Footprint Url: https://www.diodes.com/assets/Package-Files/SOD123.pdf; RoHS: TRUE; Category: Diode; Height: 1.45mm; Release Date: 1385348939; Manufacturer Part Number: 1N5819HW-7-F; Temperature: -65°C to +125°C
D?#7 = SMBJ60A: TVS DIODE, 600W, 60V, DO-214AA, FULL REEL; Product Range:TRANSZORB SMBJ Series; TVS Polarity:Unidirectional; Reverse Stand-Off Voltage Vrwm:60V; Diode Case Style:DO-214AA; No. of Pins:2Pins; Breakdown Voltage Min:66.7V ;RoHS Compliant: Yes; Manufacturer 1: Vishay Semiconductors; Manufacturer Part Number 1: SMBJ60A-E3/52; Clamping Voltage: 96.8V; Peak Pulse Current: 6.2A; Test Current: 1mA; Breakdown Voltage: 66.7V; Leakage Current: 1uA; Number of Elements: 1; Element Configuration: Single; Max Breakdown Voltage: 73.7V; ESD Protection: No; ComponentLink1URL: http://media.digikey.com/pdf/Data%20Sheets/Vishay%20Semiconductors/SMBJ5.0A_thru_188A.pdf?src-supplier=Digi-Key; ComponentLink1Description: http://media.digikey.com/pdf/Data%20Sheets/Vishay%20Semiconductors/SMBJ5.0A_thru_188A.pdf?src-supplier=Digi-Key; ComponentLink2URL: http://www.vishay.com/docs/88392/smbj.pdf?src-supplier=Digi-Key; ComponentLink2Description: http://www.vishay.com/docs/88392/smbj.pdf?src-supplier=Digi-Key; ComponentLink3URL: https://www.verical.com/server-webapp/html/getDatasheet?partID=84761&src-supplier=Verical; ComponentLink3Description: https://www.verical.com/server-webapp/html/getDatasheet?partID=84761&src-supplier=Verical; ComponentLink4URL: http://components.arrow.com/part/dataview/42825922S9422245N5680?src-supplier=Arrow; ComponentLink4Description: http://components.arrow.com/part/dataview/42825922S9422245N5680?src-supplier=Arrow; Supplier 1: Digi-Key; Supplier Part Number 1: SMBJ60A-E3/52GICT-ND; RoHS: Yes; Category: TVS Diodes; Stock 1: 694; Pricing 1: 1=0.47000, 10=0.35600, 25=0.32080, 100=0.16910, 250=0.16732 (USD); Mount: Surface Mount; Case/Package: SMB; Number of Pins: 2; Contact Plating: Tin,Matte; Min Operating Temperature: -55°C; Max Operating Temperature: 150°C; Peak Pulse Power: 600W; Polarity: Unidirectional; Reverse Standoff Voltage: 60V; Packaging: Tape and Reel; Max Surge Current: 6.2A; Package Quantity: 750; Reverse Breakdown Voltage: 66.7V; Operating Supply Voltage: 60V; Number of Channels: 1; Min Breakdown Voltage: 66.7V; Direction: Unidirectional; Max Reverse Leakage Current: 1uA; Termination: SMD/SMT; Max Power Dissipation: 600W; Power Dissipation: 600W; Length: 5.59mm; Height: 2.44mm; Width: 3.94mm; Radiation Hardening: No; Lead Free: Lead Free; ComponentLink5URL: https://datasheet.ciiva.com/15143/getdatasheetpartid-84761-15143331.pdf?src-supplier=Verical; ComponentLink5Description: https://datasheet.ciiva.com/15143/getdatasheetpartid-84761-15143331.pdf?src-supplier=Verical; ComponentLink6URL: https://datasheet.ciiva.com/4249/smbj50a-4249846.pdf?src-supplier=Arrow; ComponentLink6Description: https://datasheet.ciiva.com/4249/smbj50a-4249846.pdf?src-supplier=Arrow; ComponentLink7URL: https://datasheet.ciiva.com/330/smbj50a-330945.pdf?src-supplier=Digi-Key; ComponentLink7Description: https://datasheet.ciiva.com/330/smbj50a-330945.pdf?src-supplier=Digi-Key; ComponentLink8URL: https://datasheet.ciiva.com/330/smbj50a-330946.pdf?src-supplier=Digi-Key; ComponentLink8Description: https://datasheet.ciiva.com/330/smbj50a-330946.pdf?src-supplier=Digi-Key; ComponentLink9URL: https://datasheet.ciiva.com/330/smbj50a-330944.pdf?src-supplier=Digi-Key; ComponentLink9Description: https://datasheet.ciiva.com/330/smbj50a-330944.pdf?src-supplier=Digi-Key
D?#8 = SMBJ60A: Diode TVS Single Uni-Directional 48V 600W 2-Pin DO-214AA; Manufacturer 1: Taiwan Semiconductor; Clamping Voltage: 77.4V; Polarity: Unidirectional; Max Surge Current: 100A; Breakdown Voltage: 53.3V; Number of Channels: 1; ComponentLink1URL: http://media.digikey.com/pdf/Data%20Sheets/Vishay%20Semiconductors/SMBJ5.0A_thru_188A.pdf?src-supplier=Digi-Key; ComponentLink1Description: http://media.digikey.com/pdf/Data%20Sheets/Vishay%20Semiconductors/SMBJ5.0A_thru_188A.pdf?src-supplier=Digi-Key; ComponentLink2URL: http://www.vishay.com/docs/88392/smbj.pdf?src-supplier=Digi-Key; ComponentLink2Description: http://www.vishay.com/docs/88392/smbj.pdf?src-supplier=Digi-Key; ComponentLink3URL: https://www.verical.com/server-webapp/html/getDatasheet?partID=84761&src-supplier=Verical; ComponentLink3Description: https://www.verical.com/server-webapp/html/getDatasheet?partID=84761&src-supplier=Verical; ComponentLink4URL: http://components.arrow.com/part/dataview/42825922S9422245N5680?src-supplier=Arrow; ComponentLink4Description: http://components.arrow.com/part/dataview/42825922S9422245N5680?src-supplier=Arrow; Supplier 1: Digi-Key; Supplier Part Number 1: SMBJ48AFSCT-ND; Manufacturer Part Number 1: SMBJ48A; RoHS: No; Category: TVS Diodes; Stock 1: 16504; Pricing 1: 1=0.45000, 10=0.36300, 25=0.33200, 100=0.20860, 250=0.20624, 500=0.19312, 1000=0.13133 (USD); Number of Pins: 2; Min Operating Temperature: -65°C; Max Operating Temperature: 150°C; Packaging: Tape and Reel; Peak Pulse Power: 600W; Package Quantity: 3000; Operating Supply Voltage: 48V; Voltage Rating (DC): 48V; Power Rating: 600W; Length: 4.7mm; Height: 2.44mm; Width: 3.94mm; Lead Free: Lead Free; REACH SVHC: No SVHC; ComponentLink5URL: http://www.farnell.com/datasheets/2358777.pdf?src-supplier=Farnell; ComponentLink5Description: http://www.farnell.com/datasheets/2358777.pdf?src-supplier=Farnell; ComponentLink6URL: http://www.mouser.com/ds/2/395/SMBJ%20SERIES-231843.pdf?src-supplier=Mouser; ComponentLink6Description: http://www.mouser.com/ds/2/395/SMBJ%20SERIES-231843.pdf?src-supplier=Mouser; ComponentLink7URL: https://www.taiwansemi.com/products/datasheet/SMBJ%20SERIES_P1812.pdf?src-supplier=Digi-Key; ComponentLink7Description: https://www.taiwansemi.com/products/datasheet/SMBJ%20SERIES_P1812.pdf?src-supplier=Digi-Key
L?#1 L?#2 L?#4 = BLM18AG601SN1D: FERRITE BEAD 600 OHM 0603 1LN; ComponentLink1Description: Reference Spec; ComponentLink1URL: https://www.murata.com/en-us/products/productdata/8796738650142/ENFA0003.pdf; Supplier 1: Digi-Key; Supplier 2: Digi-Key; Supplier 3: Mouser; Supplier Part Number 1: 490-1014-1-ND; Supplier Part Number 2: 490-1014-2-ND; Supplier Part Number 3: 81-BLM11A601S
L?#3 = IND-GENERIC: FIXED IND 100UH 650MA 300 MOHM; Manufacturer: Bourns; Manufacturer Part Number: SRR7045-101M; custinv: Ansync; custprt: 100-0600-000108; Option: AB; Tolerance: 20%; Resistance: 300MR; Saturation Current: 500mA; Supplier 1: Digi-Key; Supplier Part Number 1: SRR7045-101MCT-ND; DC Current: 650mA; Inductance: 100uh; DC Resistance (DCR): 300mR
R?#17 = R-Generic: VISHAY - WSL2512R5000FEA - SMD Current Sense Resistors, AEC-Q200 WSL Series, 0.5 ohm, 1 W, - 1%, 700 mV RoHS Compliant: Yes; Manufacturer 1: Vishay Dale; Resistance: 0R5; Power Rating: 1W; Temperature Coefficient: 75ppm/°C; Voltage Rating: 700mV; Supplier 1: Digi-Key; Supplier Part Number 1: WSLG-.50CT-ND; Manufacturer Part Number 1: WSL2512R5000FEA; RoHS: Yes; Category: Chip SMD Resistors; Stock 1: 80272; Pricing 1: 1=1.16000, 10=1.02300, 25=0.94040, 50=0.85800, 100=0.74250, 250=0.62700, 500=0.52800, 1000=0.44880 (USD); Mount: Surface Mount; Case/Package: 2512; Number of Pins: 2; Weight: 0.001429oz; Contact Plating: Tin,Matte; Case Code (Imperial): 2512; Case Code (Metric): 6432; Min Operating Temperature: -65°C; Max Operating Temperature: 170°C; Tolerance: 1%; Composition: Metal Strip; Packaging: Tape and Reel; Package Quantity: 2000; Termination: SMD/SMT; Military Standard: Not; Length: 6.35mm; Height: 0.635mm; Width: 3.2mm; Depth: 3.18mm; Radiation Hardening: No; Lead Free: Lead Free; REACH SVHC: Unknown; ComponentLink1URL: https://datasheet.ciiva.com/15159/getdatasheetpartid-92560-15159917.pdf?src-supplier=Verical; ComponentLink1Description: https://datasheet.ciiva.com/15159/getdatasheetpartid-92560-15159917.pdf?src-supplier=Verical; ComponentLink2URL: https://datasheet.ciiva.com/11812/0900766b80d81e3e-11812159.pdf?src-supplier=RSComponents; ComponentLink2Description: https://datasheet.ciiva.com/11812/0900766b80d81e3e-11812159.pdf?src-supplier=RSComponents; ComponentLink3URL: https://datasheet.ciiva.com/16722/70201098-16722472.pdf?src-supplier=Allied+Electronics; ComponentLink3Description: https://datasheet.ciiva.com/16722/70201098-16722472.pdf?src-supplier=Allied+Electronics; ComponentLink4URL: https://datasheet.ciiva.com/28671/wsl-28671816.pdf?src-supplier=Element14; ComponentLink4Description: https://datasheet.ciiva.com/28671/wsl-28671816.pdf?src-supplier=Element14; ComponentLink5URL: https://datasheet.ciiva.com/16507/wsl-16507529.pdf?src-supplier=Future+Electronics; ComponentLink5Description: https://datasheet.ciiva.com/16507/wsl-16507529.pdf?src-supplier=Future+Electronics; ComponentLink6URL: https://datasheet.ciiva.com/7702/442550-7702493.pdf?src-supplier=Element14; ComponentLink6Description: https://datasheet.ciiva.com/7702/442550-7702493.pdf?src-supplier=Element14; ComponentLink7URL: https://datasheet.ciiva.com/7702/442550-7702494.pdf?src-supplier=Element14; ComponentLink7Description: https://datasheet.ciiva.com/7702/442550-7702494.pdf?src-supplier=Element14; ComponentLink8URL: https://datasheet.ciiva.com/8932/wsl-8932367.pdf?src-supplier=Avnet; ComponentLink8Description: https://datasheet.ciiva.com/8932/wsl-8932367.pdf?src-supplier=Avnet
R?#18 = R-Generic-0603: RES SMD 330K OHM 5% 1/10W 0603; Manufacturer: Yageo; Manufacturer Part Number: RC0603JR-07330KL; custprt: 100-0110-000011; custinv: Ansync; Option: AB; Resistance: 330kR; Power Rating: 100mW; Voltage Rating: 75V; Voltage Rating (DC): 50V; Temperature Coefficient: 100ppm/°C; Supplier 1: Digi-Key; Supplier Part Number 1: 311-330KGRCT-ND; Stock 1: 271870; Pricing 1: 1=0.1, 10=0.022, 100=0.0088, 1000=0.00396, 2500=0.00344 (USD); Case/Package: 0603; Number of Pins: 2; Weight: 7.1E-05oz; Case Code (Imperial): 0603; Case Code (Metric): 1608; Min Operating Temperature: -55°C; Max Operating Temperature: 155°C; Tolerance: 5%; Packaging: Tape and Reel; Package Quantity: 1; Termination: SMD/SMT; Composition: Thick Film; Number of Terminations: 2; Military Standard: Not; Max Power Dissipation: 100mW; Features: Moisture Resistant; Length: 1.6mm; Height: 0.022inch; Width: 0.8mm; Depth: 0.8mm; REACH SVHC: No SVHC; Lead Free: Lead Free; ComponentLink1URL: http://www.yageo.com/documents/recent/PYu-RC_Group_51_RoHS_L_9.pdf; ComponentLink1Description: http://www.yageo.com/documents/recent/PYu-RC_Group_51_RoHS_L_9.pdf; ComponentLink2URL: http://www.farnell.com/datasheets/443971.pdf; ComponentLink2Description: http://www.farnell.com/datasheets/443971.pdf; ComponentLink3URL: https://www.verical.com/server-webapp/html/getDatasheet?partID=323834; ComponentLink3Description: https://www.verical.com/server-webapp/html/getDatasheet?partID=323834
R?#19 = R-Generic-0402: RES SMD 15K OHM 1% 1/16W 0402; Manufacturer: Yageo; Manufacturer Part Number: RC0402FR-0715KL; custinv: Ansync; custprt: 100-0120-000195; Option: AB; Power Rating: 62.5mW; Resistance: 15kR; Voltage Rating: 50V; Temperature Coefficient: 100ppm/°C; Max Power Dissipation: 63mW; Supplier 1: Digi-Key; Supplier Part Number 1: 311-15.0KLRCT-ND; Stock 1: 2807614; Pricing 1: 1=0.1, 10=0.018, 100=0.0073, 1000=0.00329, 2500=0.00286, 5000=0.00236 (USD); Case/Package: 0402; Number of Pins: 2; Weight: 2.3E-05oz; Case Code (Imperial): 0402; Case Code (Metric): 1005; Min Operating Temperature: -55°C; Max Operating Temperature: 155°C; Tolerance: 1%; Packaging: Tape and Reel; Package Quantity: 1; Termination: SMD/SMT; Composition: Thick Film; Number of Terminations: 2; Military Standard: Not; Voltage Rating (DC): 50V; Features: Moisture Resistant; Length: 1mm; Height: 0.016inch; Width: 0.5mm; Depth: 0.5mm; REACH SVHC: No SVHC; Lead Free: Lead Free; ComponentLink1URL: http://www.farnell.com/datasheets/1018594.pdf; ComponentLink1Description: http://www.farnell.com/datasheets/1018594.pdf; ComponentLink2URL: http://www.mouser.com/ds/2/447/PYu-RC0402_51_RoHS_L_6_r-8721.pdf; ComponentLink2Description: http://www.mouser.com/ds/2/447/PYu-RC0402_51_RoHS_L_6_r-8721.pdf; ComponentLink3URL: http://www.yageo.com/documents/recent/PYu-RC_Group_51_RoHS_L_9.pdf; ComponentLink3Description: http://www.yageo.com/documents/recent/PYu-RC_Group_51_RoHS_L_9.pdf; ComponentLink4URL: http://www.yageo.com/documents/recent/PYu-RC0402_51_RoHS_L_6_r.pdf; ComponentLink4Description: http://www.yageo.com/documents/recent/PYu-RC0402_51_RoHS_L_6_r.pdf
R?#20 = R-Generic-0402: RES SMD 40.2K OHM 1% 1/16W 0402; Manufacturer: Yageo; Manufacturer Part Number: RC0402FR-0740K2L; custinv: Ansync; custprt: 100-0120-000050; Option: AB; Resistance: 40.2kR; Temperature Coefficient: 100ppm/°C; Power Rating: 62.5mW; Voltage Rating: 50V; Max Power Dissipation: 63mW; Supplier 1: Digi-Key; Supplier Part Number 1: 311-40.2KLRCT-ND; Stock 1: 1176562; Pricing 1: 1=0.09, 10=0.016, 100=0.0064, 1000=0.00288, 2500=0.0025, 5000=0.00206 (EUR); Case/Package: 0402; Contact Plating: Matte,Tin; Case Code (Metric): 1005; Case Code (Imperial): 0402; Min Operating Temperature: -55°C; Max Operating Temperature: 155°C; Tolerance: 1%; Composition: Thick Film; Package Quantity: 1; Packaging: Tape and Reel; Number of Terminations: 2; Termination: SMD/SMT; Military Standard: Not; Voltage Rating (DC): 50V; Features: Moisture Resistant; Length: 0.039inch; Height: 0.016inch; Width: 0.02inch; Depth: 0.5mm; Lead Free: Lead Free; ComponentLink1URL: http://www.yageo.com/documents/recent/PYu-RC0402_51_RoHS_L_6.pdf; ComponentLink1Description: http://www.yageo.com/documents/recent/PYu-RC0402_51_RoHS_L_6.pdf; ComponentLink2URL: http://www.yageo.com/documents/recent/PYu-RC_Group_51_RoHS_L_9.pdf; ComponentLink2Description: http://www.yageo.com/documents/recent/PYu-RC_Group_51_RoHS_L_9.pdf; ComponentLink3URL: http://www.mouser.com/ds/2/447/PYu-RC0402_51_RoHS_L_6_r-8721.pdf; ComponentLink3Description: http://www.mouser.com/ds/2/447/PYu-RC0402_51_RoHS_L_6_r-8721.pdf; ComponentLink4URL: http://www.yageo.com/documents/recent/PYu-RC0402_51_RoHS_L_6_r.pdf; ComponentLink4Description: http://www.yageo.com/documents/recent/PYu-RC0402_51_RoHS_L_6_r.pdf
U?#2 = LTC3630A: IC REG BUCK INV 0.5A SYNC 16MSOP; Manufacturer: Analog Devices / Linear Technology; Manufacturer Part Number: LTC3630AIMSE#TRPBF; custinv: Ansync; custprt: 100-0700-000511; Option: AB; Output Current: 500mA; Number of Outputs: 1; Output Voltage: 76V; Synchronous Rectifier: Yes; Min Input Voltage: 4V; Output Type: Adjustable; Supplier 1: Digi-Key; Supplier Part Number 1: LTC3630AIMSE#TRPBFCT-ND; Supplier 2: Newark; Supplier Part Number 2: 95W3377; Case/Package: SOP; Number of Pins: 12; Min Operating Temperature: -40°C; Max Operating Temperature: 125°C; Package Quantity: 37; Packaging: Rail/Tube; ComponentLink1URL: http://www.linear.com/docs/44087; ComponentLink1Description: http://www.linear.com/docs/44087

## Sheet BMU_V50_CAN.SchDoc
size C
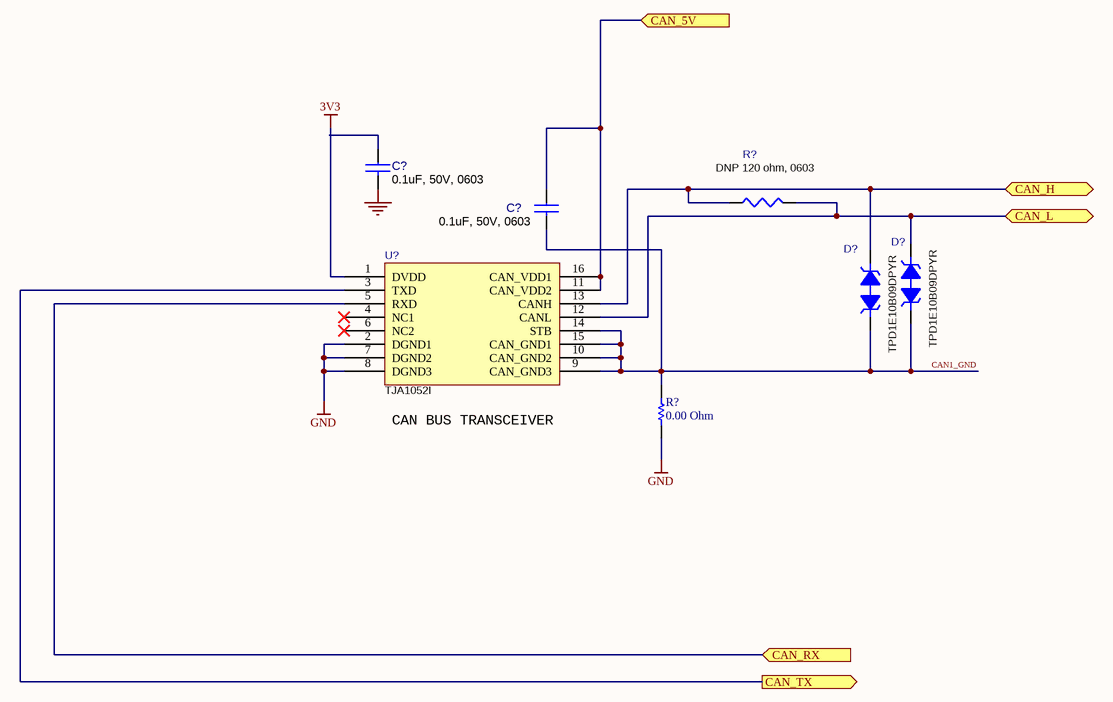
[diagram p11: BMU_V50_CAN.SchDoc]

### Parts
(Parts that share a designator on the sheet are numbered #1, #2 ... from top to bottom, then left to right.)
C?#17  0.1uF, 50V, 0603  [C0603]
C?#18  0.1uF, 50V, 0603  [C0603]
D?#9  TPD1E10B09DPYR  [2X2SON]
D?#10  TPD1E10B09DPYR  [2X2SON]
R?#21  DNP 120 ohm, 0603  [R0603]  (no BOM)
R?#22  value 0.00 Ohm  [RESC0402(1005)_L]  (hidden comment: Jumper 0402(1005))
U?#3  TJA1052I  [16-SOIC]

### Ports
CAN_5V (in), CAN_H (bidir), CAN_L (bidir), CAN_RX (in), CAN_TX (out)

### Nets
3V3: U?#3.1(DVDD)
GND: C?#17.2 R?#22.2 U?#3.2(DGND1) U?#3.7(DGND2) U?#3.8(DGND3)
CAN1_GND: C?#18.2 D?#9.1 D?#10.1 R?#22.1 U?#3.9(CAN_GND3) U?#3.10(CAN_GND2) U?#3.14(STB) U?#3.15(CAN_GND1)
CAN1_RX: U?#3.5(RXD) ; port CAN_RX
CAN1_TX: U?#3.3(TXD) ; port CAN_TX
CAN_H: D?#10.2 R?#21.1 U?#3.13(CANH) ; port CAN_H
CAN_L: D?#9.2 R?#21.2 U?#3.12(CANL) ; port CAN_L
NetC?#18_1: C?#18.1 U?#3.11(CAN_VDD2) U?#3.16(CAN_VDD1) ; port CAN_5V

Not connected (* = marked no-connect by the designer): C?#17 1; U?#3 4(NC1)* 6(NC2)*

### Notes on the sheet
- (near R?#22) CAN BUS TRANSCEIVER
- Title
- MATTERNET
- PROPRIETRY & CONFIDENTIAL
  THE INFORMATION CONTAINS IN THIS DRAWING
  IS THE SOLE PROPERTY OF  MATTERNET Inc.
  ANY REPRODUCTION IN PART OR AS WHOLE
  WITHOUT A WRITTEN PERMISSION OF
  MATTERNET Inc. IS PROHIBITED
- Size:
- Date:
- File:
- C
- Number:
- Time:
- Revision:
- Sheet
- of
- 161 E. Evelyn Ave.
- Mountain View,
- CA 94041 USA

### Library data of the parts
C?#17 C?#18 = CAP-Generic-0603: as C?#2-C?#5 on sheet BMU_V50_MCUcomplex; Supplier 1: Digi-Key; Supplier Part Number 1: 490-16477-1-ND; Stock 1: 2560; Pricing 1: 1=0.22, 10=0.152, 100=0.077, 500=0.0527, 1000=0.04662 (USD); Case/Package: 0603; Supplier 2: Mouser; Supplier Part Number 2: 81-GCJ188R71E104KA2D; Stock 2: 47905; Pricing 2: 1=0.21, 10=0.139, 50=0.139, 100=0.071, 1000=0.043, 10000=0.035 (USD)
D?#9 D?#10 = ESD BI-DIR TRIG 9VDC 0402_0: TVS DIODE 9VWM 20VC 2X2SON; Manufacturer: Texas Instruments; custinv: Ansync; custprt: 100-0500-000170; Option: AB; Direction: Bidirectional; Capacitance: 10pF; Number of Channels: 1; Reverse Standoff Voltage: 9V; Clamping Voltage: 20V; Peak Pulse Power: 90W; Power Line Protection: No; Breakdown Voltage: 9.5V; Leakage Current: 100nA; ESD Protection: Yes; Test Current: 1mA; Element Configuration: Single; Peak Pulse Current: 4.5A; TYPE: Diode; Supplier 1: Digi-Key; Supplier Part Number 1: 296-30405-1-ND; Manufacturer Part Number: TPD1E10B09DPYR; Stock 1: 89820; Pricing 1: 1=0.45, 10=0.336, 100=0.2096, 500=0.1434, 1000=0.11031 (USD); Case/Package: 0402; Number of Pins: 2; Contact Plating: Gold; Min Operating Temperature: -40°C; Max Operating Temperature: 125°C; Packaging: Tape and Reel; Package Quantity: 1; Number of Bidirectional Channels: 1; Min Breakdown Voltage: 9V; Working Voltage: 9V; Max Reverse Leakage Current: 100nA; Operating Supply Voltage: 9V; Composition: Zener; Length: 1.1mm; Height: 0.4mm; Width: 0.7mm; Radiation Hardening: No; REACH SVHC: No SVHC; Lead Free: Lead Free; ComponentLink1URL: http://www.ti.com/general/docs/lit/getliterature.tsp?genericPartNumber=TPD1E10B09&&fileType=pdf; ComponentLink1Description: http://www.ti.com/general/docs/lit/getliterature.tsp?genericPartNumber=TPD1E10B09&&fileType=pdf; ComponentLink2URL: http://www.ti.com/lit/ds/sllseb0b/sllseb0b.pdf; ComponentLink2Description: http://www.ti.com/lit/ds/sllseb0b/sllseb0b.pdf; ComponentLink3URL: http://www.ti.com/lit/ds/symlink/tpd1e10b09.pdf; ComponentLink3Description: http://www.ti.com/lit/ds/symlink/tpd1e10b09.pdf
R?#21 = R-Generic-0603: custprt: 100-0100-000119; custinv: Ansync; Option: C
R?#22 = CMP-1011-00001-1: as R?#7 on sheet BMU_V50_MCUcomplex; Power: None; Technology: SMT
U?#3 = TJA1052I: CAN Bus, Transceiver SOIC; Manufacturer: NXP Semiconductors; Manufacturer Part Number: TJA1052IT/5Y; Max Supply Voltage: 5.25V; Number of Transmit Buffers: 1; Min Supply Voltage: 3V; Data Rate: 5Mbps; Number of Channels: 2; Channel Type: Unidirectional; Isolated Power: No; Supplier 1: Digi-Key; Supplier Part Number 1: 568-11942-1-ND; Stock 1: 1928; Pricing 1: 1=5.27, 10=4.732, 100=3.8768, 500=3.30026 (USD); Case/Package: SOIC; Number of Pins: 16; Min Operating Temperature: -40°C; Max Operating Temperature: 125°C; Number of Receive Buffers: 1; Packaging: Cut Tape; Interface: CAN; Number of Transceivers: 1; Radiation Hardening: No; REACH SVHC: No SVHC; ComponentLink1URL: http://www.farnell.com/datasheets/2045698.pdf; ComponentLink1Description: http://www.farnell.com/datasheets/2045698.pdf; ComponentLink2URL: http://www.nxp.com/documents/data_sheet/TJA1052I.pdf; ComponentLink2Description: http://www.nxp.com/documents/data_sheet/TJA1052I.pdf